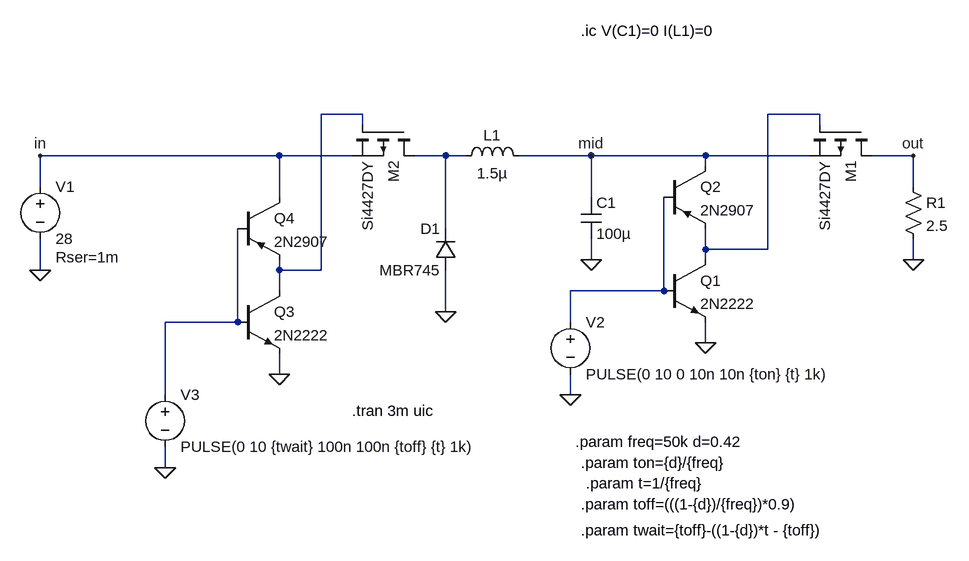
[diagram p0: schematic chopper.asc]
chopper.asc, the LTspice schematic file:
Version 4.1
SHEET 1 880 704
WIRE -368 48 -432 48
WIRE 336 48 256 48
WIRE -368 64 -368 48
WIRE 336 64 336 48
WIRE -496 112 -864 112
WIRE -384 112 -496 112
WIRE -240 112 -288 112
WIRE -208 112 -240 112
WIRE -16 112 -128 112
WIRE 160 112 -16 112
WIRE 320 112 160 112
WIRE 480 112 416 112
WIRE 160 128 160 112
WIRE -864 160 -864 112
WIRE 480 160 480 112
WIRE -496 176 -496 112
WIRE -16 176 -16 112
WIRE -240 224 -240 112
WIRE 160 256 160 224
WIRE 256 256 256 48
WIRE 256 256 160 256
WIRE -16 272 -16 240
WIRE 160 272 160 256
WIRE 480 272 480 240
WIRE -864 288 -864 240
WIRE -496 288 -496 272
WIRE -432 288 -432 48
WIRE -432 288 -496 288
WIRE -496 320 -496 288
WIRE 96 320 96 176
WIRE 96 320 -48 320
WIRE -240 352 -240 288
WIRE -560 368 -560 224
WIRE -560 368 -672 368
WIRE -48 368 -48 320
WIRE 160 400 160 368
WIRE -496 448 -496 416
WIRE -672 480 -672 368
WIRE -48 480 -48 448
WIRE -672 592 -672 560
FLAG -864 288 0
FLAG -16 272 0
FLAG 480 272 0
FLAG 160 400 0
FLAG -48 480 0
FLAG 480 112 out
FLAG -864 112 in
FLAG -16 112 mid
FLAG -496 448 0
FLAG -672 592 0
FLAG -240 352 0
SYMBOL ind -224 128 R270
WINDOW 0 32 56 VTop 2
WINDOW 3 5 56 VBottom 2
SYMATTR InstName L1
SYMATTR Value 1.5µ
SYMATTR SpiceLine Ipk=10 Rser=20m Cpar=10p
SYMBOL voltage -864 144 R0
WINDOW 123 0 0 Left 0
WINDOW 39 24 124 Left 2
SYMATTR InstName V1
SYMATTR Value 28
SYMATTR SpiceLine Rser=1m
SYMBOL cap -32 176 R0
SYMATTR InstName C1
SYMATTR Value 100µ
SYMATTR SpiceLine Rser=5m
SYMBOL pmos 416 64 R90
SYMATTR InstName M1
SYMATTR Value Si4427DY
SYMBOL res 464 144 R0
SYMATTR InstName R1
SYMATTR Value 2.5
SYMBOL voltage -48 352 R0
WINDOW 123 0 0 Left 0
WINDOW 39 0 0 Left 0
SYMATTR InstName V2
SYMATTR Value PULSE(0 10 0 10n 10n {ton} {t} 1k)
SYMBOL npn 96 272 R0
SYMATTR InstName Q1
SYMATTR Value 2N2222
SYMBOL pnp 96 128 R0
SYMATTR InstName Q2
SYMATTR Value 2N2907
SYMBOL pmos -288 64 R90
SYMATTR InstName M2
SYMATTR Value Si4427DY
SYMBOL npn -560 320 R0
SYMATTR InstName Q3
SYMATTR Value 2N2222
SYMBOL pnp -560 176 R0
SYMATTR InstName Q4
SYMATTR Value 2N2907
SYMBOL voltage -672 464 R0
WINDOW 123 0 0 Left 0
WINDOW 39 0 0 Left 0
SYMATTR InstName V3
SYMATTR Value PULSE(0 10 {twait} 100n 100n {toff} {t} 1k)
SYMBOL diode -224 288 R180
WINDOW 0 24 64 Left 2
WINDOW 3 24 0 Left 2
SYMATTR InstName D1
SYMATTR Value MBR745
SYMATTR Description Diode
SYMATTR Type diode
TEXT -384 504 Left 2 !.tran 3m uic
TEXT -32 -80 Left 2 !.ic V(C1)=0 I(L1)=0
TEXT -40 552 Left 2 !.param freq=50k d=0.42
TEXT -32 584 Left 2 !.param ton={d}/{freq}
TEXT -24 616 Left 2 !.param t=1/{freq}
TEXT -32 648 Left 2 !.param toff=(((1-{d})/{freq})*0.9)
TEXT -32 688 Left 2 !.param twait={toff}-((1-{d})*t - {toff})

The netlist it stands for:
* chopper.asc
L1 N003 mid 1.5µ Ipk=10 Rser=20m Cpar=10p
V1 in 0 28 Rser=1m
C1 mid 0 100µ Rser=5m
M1 out N002 mid mid Si4427DY
R1 out 0 2.5
V2 N004 0 PULSE(0 10 0 10n 10n {ton} {t} 1k)
Q1 N002 N004 0 0 2N2222
Q2 mid N004 N002 0 2N2907
M2 N003 N001 in in Si4427DY
Q3 N001 N005 0 0 2N2222
Q4 in N005 N001 0 2N2907
V3 N005 0 PULSE(0 10 {twait} 100n 100n {toff} {t} 1k)
D1 0 N003 MBR745
.model D D
.lib standard.dio
.model NPN NPN
.model PNP PNP
.lib standard.bjt
.model NMOS NMOS
.model PMOS PMOS
.lib standard.mos
.tran 3m uic
.ic V(C1)=0 I(L1)=0
.param freq=50k d=0.42
.param ton={d}/{freq}
.param t=1/{freq}
.param toff=(((1-{d})/{freq})*0.9)
.param twait={toff}-((1-{d})*t - {toff})
.backanno
.end